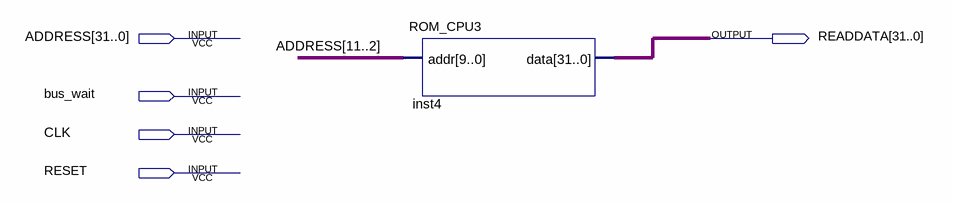
[diagram p0: schematic sheet]
// Quartus schematic InstrctionMemory2.bdf as structural Verilog: 1 symbols, 5 pins
module InstrctionMemory2 (
  input  [31:0] ADDRESS,
  input  bus_wait,
  input  CLK,
  input  RESET,
  output [31:0] READDATA
);

  ROM_CPU3 inst4 (.addr(ADDRESS[11:2]), .data(READDATA));
endmodule
